# Altium schematic sheet bob_breakout-jetson_nano.SchDoc
size A4; SheetNumber: 3; SheetTotal: 2
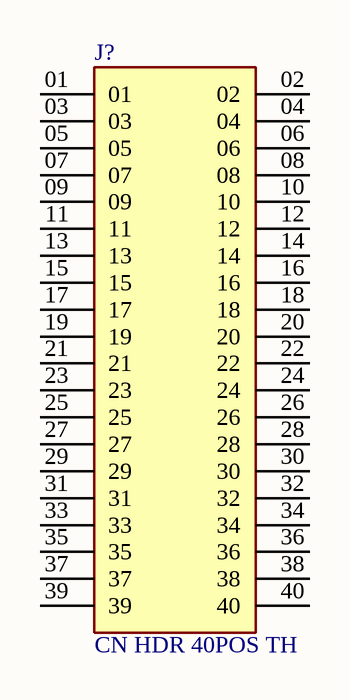
[diagram p0: bob_breakout-jetson_nano.SchDoc]

## Parts
J?  CN HDR 40POS TH  [SAMTEC_SSQ-120-22-G-D]

## Nets

Not connected (* = marked no-connect by the designer): J? 01 02 03 04 05 06 07 08 09 10 11 12 13 14 15 16 17 18 19 20 21 22 23 24 25 26 27 28 29 30 31 32 33 34 35 36 37 38 39 40

## Library data of the parts
J? = CN HDR 40POS TH: SSQ - Samtec 2.54mm Square Tail Dual Row Socket Strip 8.5mm Profile; MP: SSQ-120-22-G-D; Value: *; Price: None; Package: None; MF: Samtec; Check_prices: https://www.snapeda.com/parts/SSQ-120-22-G-D/Samtec/view-part/3393219/?ref=eda; Availability: In Stock; SnapEDA_Link: https://www.snapeda.com/parts/SSQ-120-22-G-D/Samtec/view-part/3393219/?ref=snap; Purchase-URL: https://pricing.snapeda.com/search/part/SSQ-120-22-G-D/?ref=eda; Digikey: S6104-ND